# Altium schematic sheet global.SchDoc
size A4; DrawnBy: Martin Ongsiek; Organization: DAS LABOR; Address1: Rotstr. 31; Address2: Bochum
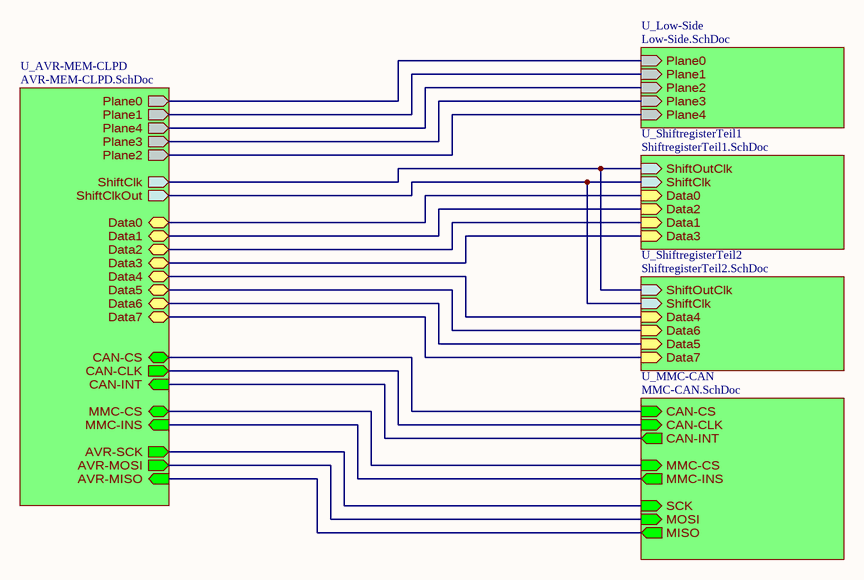
[diagram p0: global.SchDoc]

## Sub-sheets
U_AVR-MEM-CLPD = AVR-MEM-CLPD.SchDoc: Data0 (bidir), Data1 (bidir), Data2 (bidir), Data3 (bidir), Data4 (bidir), Data5 (bidir), Data6 (bidir), Data7 (bidir), Plane0 (out), Plane1 (out), Plane4 (out), Plane3 (out), Plane2 (out), AVR-MISO (in), AVR-MOSI (out), AVR-SCK (out), MMC-CS (bidir), CAN-CS (bidir), CAN-INT (in), CAN-CLK (out), ShiftClk (out), ShiftClkOut (out), MMC-INS (in)
U_Low-Side = Low-Side.SchDoc: Plane4 (in), Plane3 (in), Plane2 (in), Plane1 (in), Plane0 (in)
U_MMC-CAN = MMC-CAN.SchDoc: CAN-CS (in), MOSI (in), MMC-CS (in), SCK (in), MISO (out), CAN-INT (out), CAN-CLK (in), MMC-INS (out)
U_ShiftregisterTeil1 = ShiftregisterTeil1.SchDoc: ShiftOutClk (in), ShiftClk (in), Data0 (in), Data2 (in), Data1 (in), Data3 (in)
U_ShiftregisterTeil2 = ShiftregisterTeil2.SchDoc: ShiftOutClk (in), ShiftClk (in), Data4 (in), Data6 (in), Data5 (in), Data7 (in)

## Nets
(unnamed): sheet U_AVR-MEM-CLPD/Data0, sheet U_ShiftregisterTeil1/Data0
(unnamed): sheet U_AVR-MEM-CLPD/Data1, sheet U_ShiftregisterTeil1/Data2
(unnamed): sheet U_AVR-MEM-CLPD/Data2, sheet U_ShiftregisterTeil1/Data1
(unnamed): sheet U_AVR-MEM-CLPD/Data3, sheet U_ShiftregisterTeil1/Data3
(unnamed): sheet U_AVR-MEM-CLPD/Data4, sheet U_ShiftregisterTeil2/Data4
(unnamed): sheet U_AVR-MEM-CLPD/Data5, sheet U_ShiftregisterTeil2/Data6
(unnamed): sheet U_AVR-MEM-CLPD/Data6, sheet U_ShiftregisterTeil2/Data5
(unnamed): sheet U_AVR-MEM-CLPD/Data7, sheet U_ShiftregisterTeil2/Data7
(unnamed): sheet U_AVR-MEM-CLPD/Plane0, sheet U_Low-Side/Plane0
(unnamed): sheet U_AVR-MEM-CLPD/Plane1, sheet U_Low-Side/Plane1
(unnamed): sheet U_AVR-MEM-CLPD/Plane4, sheet U_Low-Side/Plane2
(unnamed): sheet U_AVR-MEM-CLPD/Plane3, sheet U_Low-Side/Plane3
(unnamed): sheet U_AVR-MEM-CLPD/Plane2, sheet U_Low-Side/Plane4
(unnamed): sheet U_AVR-MEM-CLPD/AVR-MISO, sheet U_MMC-CAN/MISO
(unnamed): sheet U_AVR-MEM-CLPD/AVR-MOSI, sheet U_MMC-CAN/MOSI
(unnamed): sheet U_AVR-MEM-CLPD/AVR-SCK, sheet U_MMC-CAN/SCK
(unnamed): sheet U_AVR-MEM-CLPD/MMC-CS, sheet U_MMC-CAN/MMC-CS
(unnamed): sheet U_AVR-MEM-CLPD/CAN-CS, sheet U_MMC-CAN/CAN-CS
(unnamed): sheet U_AVR-MEM-CLPD/CAN-INT, sheet U_MMC-CAN/CAN-INT
(unnamed): sheet U_AVR-MEM-CLPD/CAN-CLK, sheet U_MMC-CAN/CAN-CLK
(unnamed): sheet U_AVR-MEM-CLPD/ShiftClk, sheet U_ShiftregisterTeil1/ShiftOutClk, sheet U_ShiftregisterTeil2/ShiftOutClk
(unnamed): sheet U_AVR-MEM-CLPD/ShiftClkOut, sheet U_ShiftregisterTeil1/ShiftClk, sheet U_ShiftregisterTeil2/ShiftClk
(unnamed): sheet U_AVR-MEM-CLPD/MMC-INS, sheet U_MMC-CAN/MMC-INS